# EAGLE design ibee (EAGLE 6.6.0)
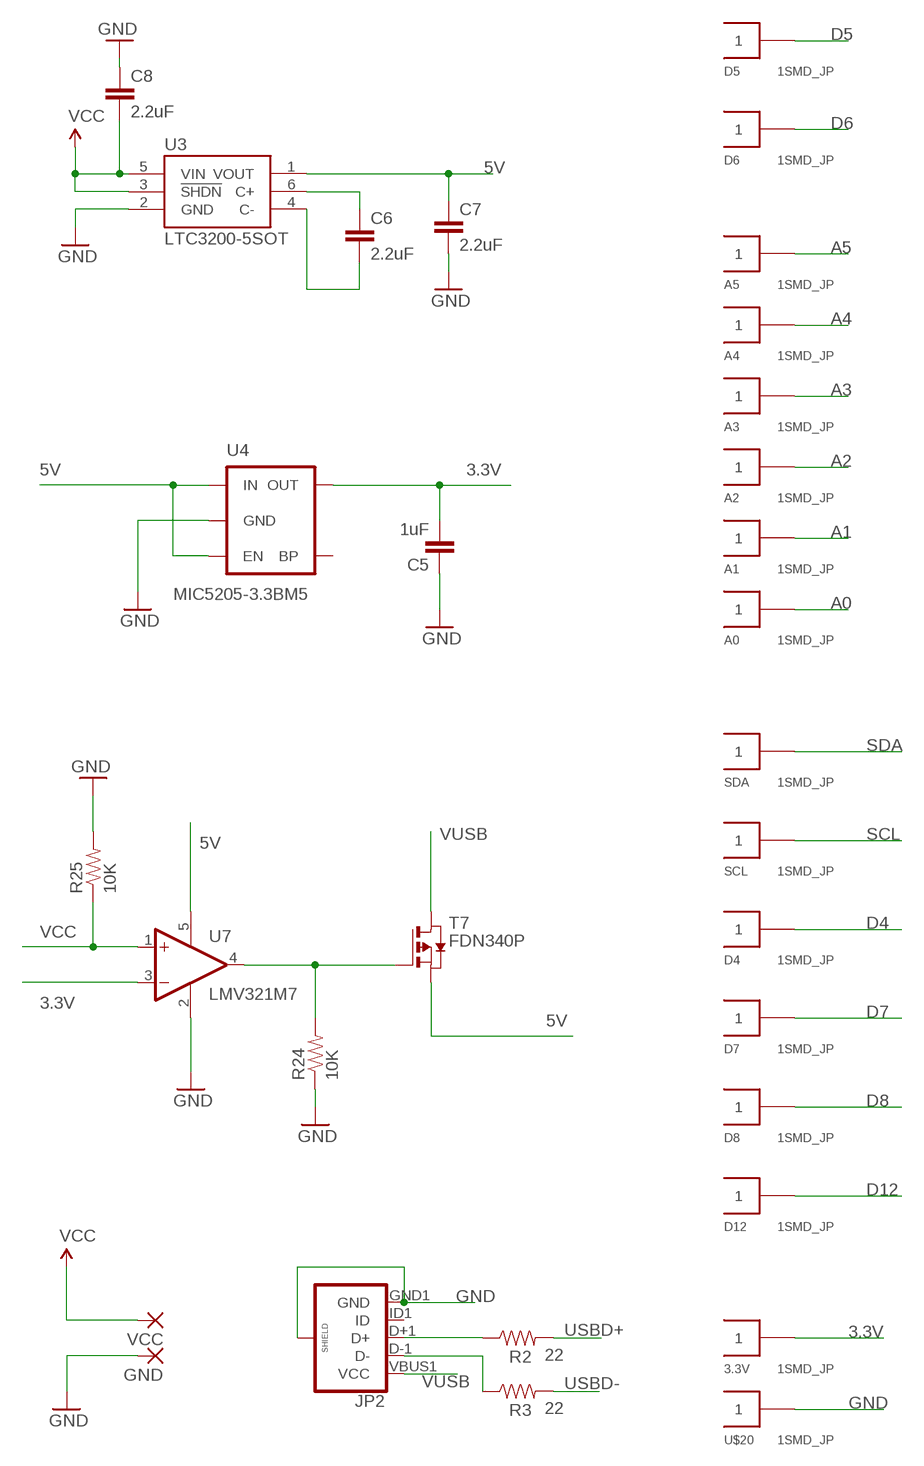
[diagram p0: schematic, sheet 1, part 1 of 2]
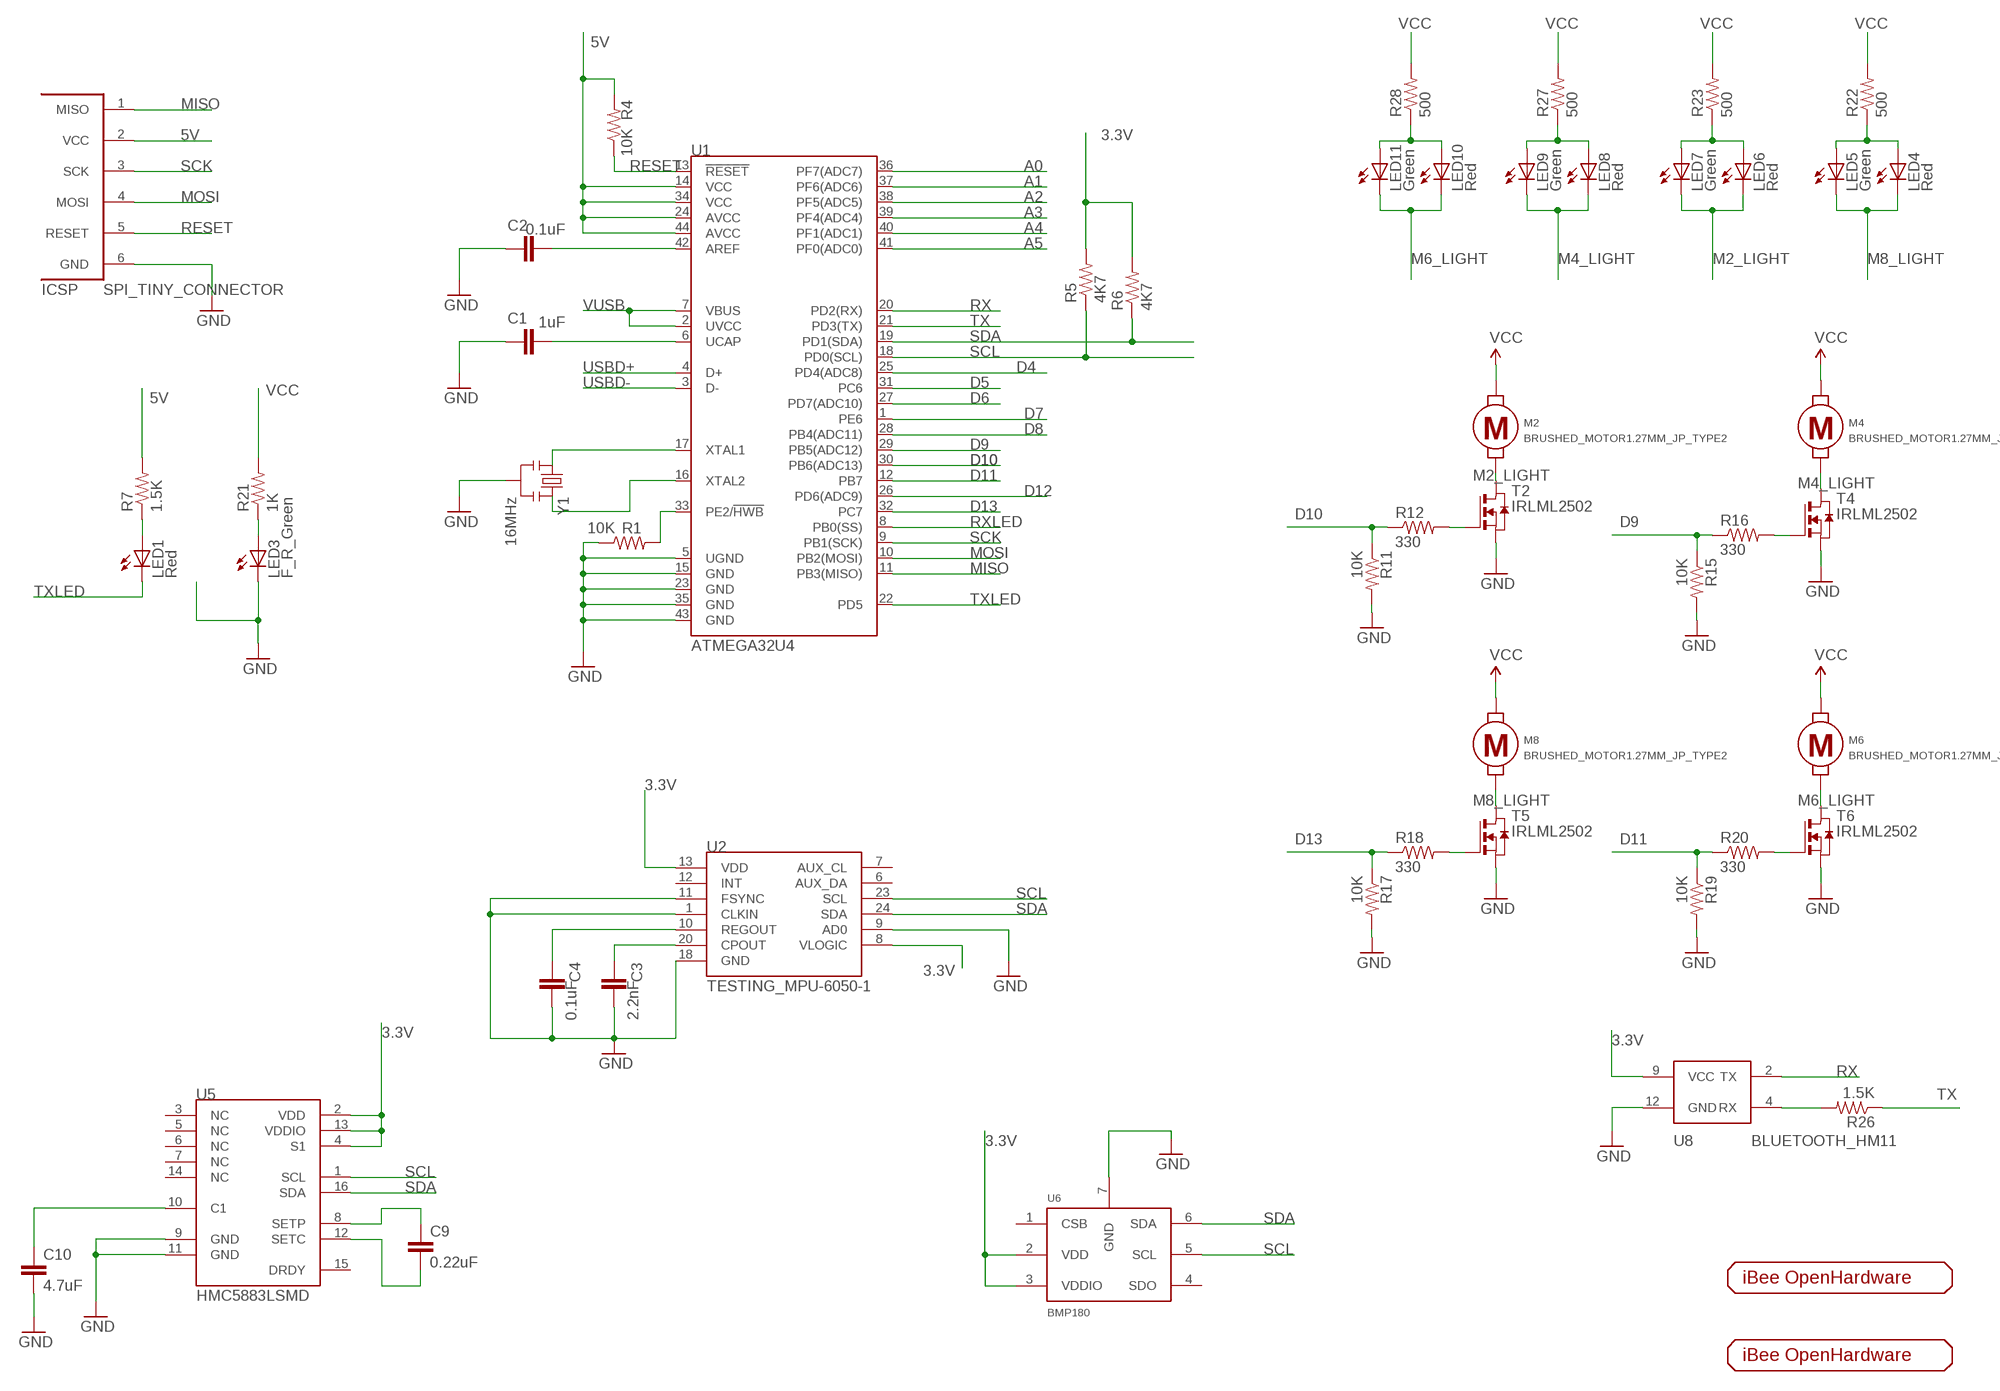
[diagram p1: schematic, sheet 1, part 2 of 2]

## Parts
3.3V  1SMD_JP  [1SMD]
A0  1SMD_JP  [1SMD]
A1  1SMD_JP  [1SMD]
A2  1SMD_JP  [1SMD]
A3  1SMD_JP  [1SMD]
A4  1SMD_JP  [1SMD]
A5  1SMD_JP  [1SMD]
C1  1uF  CAP0402-CAP  [0402-CAP]
C2  0.1uF  CAP0402-CAP  [0402-CAP]
C3  2.2nF  CAP0402-CAP  [0402-CAP]
C4  0.1uF  CAP0402-CAP  [0402-CAP]
C5  1uF  CAP0402-CAP  [0402-CAP]
C6  2.2uF  CAP0603-CAP  [0603-CAP]
C7  2.2uF  CAP0603-CAP  [0603-CAP]
C8  2.2uF  CAP0603-CAP  [0603-CAP]
C9  0.22uF  CAP0402-CAP  [0402-CAP]
C10  4.7uF  CAP0603-CAP  [0603-CAP]
D4  1SMD_JP  [1SMD]
D5  1SMD_JP  [1SMD]
D6  1SMD_JP  [1SMD]
D7  1SMD_JP  [1SMD]
D8  1SMD_JP  [1SMD]
D12  1SMD_JP  [1SMD]
GND  2,15/1,0  [2,15/1,0]
ICSP  SPI_TINY_CONNECTOR  AVR_ISP_TINY_CONNECTORAVR_ISP_TINY_CONNCTOR_NO_BORDER  [AVR_ISP_TINY_CONNECTOR_NO_BORDER]
JP2  USB_MICROB_PLUGCONN-11752  [USB-B-MICRO-SMD_V03]
LED1  Red  LEDCHIPLED_0603  [CHIPLED_0603]
LED3  F_R_Green  LEDCHIPLED_0603  [CHIPLED_0603]
LED4  Red  LEDCHIPLED_0603  [CHIPLED_0603]
LED5  Green  LEDCHIPLED_0603  [CHIPLED_0603]
LED6  Red  LEDCHIPLED_0603  [CHIPLED_0603]
LED7  Green  LEDCHIPLED_0603  [CHIPLED_0603]
LED8  Red  LEDCHIPLED_0603  [CHIPLED_0603]
LED9  Green  LEDCHIPLED_0603  [CHIPLED_0603]
LED10  Red  LEDCHIPLED_0603  [CHIPLED_0603]
LED11  Green  LEDCHIPLED_0603  [CHIPLED_0603]
M2  BRUSHED_MOTOR1.27MM_JP_TYPE2  [BRUSHED_MOTOR_1.27MM_JP_TYPE2]
M4  BRUSHED_MOTOR1.27MM_JP  [BRUSHED_MOTOR_1.27MM_JP]
M6  BRUSHED_MOTOR1.27MM_JP  [BRUSHED_MOTOR_1.27MM_JP]
M8  BRUSHED_MOTOR1.27MM_JP_TYPE2  [BRUSHED_MOTOR_1.27MM_JP_TYPE2]
R1  10K  RESISTOR0402-RES  [0402-RES]
R2  22  RESISTOR0402-RES  [0402-RES]
R3  22  RESISTOR0402-RES  [0402-RES]
R4  10K  RESISTOR0402-RES  [0402-RES]
R5  4K7  RESISTOR0402-RES  [0402-RES]
R6  4K7  RESISTOR0402-RES  [0402-RES]
R7  1.5K  RESISTOR0402-RES  [0402-RES]
R11  10K  RESISTOR0402-RES  [0402-RES]
R12  330  RESISTOR0402-RES  [0402-RES]
R15  10K  RESISTOR0402-RES  [0402-RES]
R16  330  RESISTOR0402-RES  [0402-RES]
R17  10K  RESISTOR0402-RES  [0402-RES]
R18  330  RESISTOR0402-RES  [0402-RES]
R19  10K  RESISTOR0402-RES  [0402-RES]
R20  330  RESISTOR0402-RES  [0402-RES]
R21  1K  RESISTOR0402-RES  [0402-RES]
R22  500  RESISTOR0402-RES  [0402-RES]
R23  500  RESISTOR0402-RES  [0402-RES]
R24  10K  RESISTOR0402-RES  [0402-RES]
R25  10K  RESISTOR0402-RES  [0402-RES]
R26  1.5K  RESISTOR0402-RES  [0402-RES]
R27  500  RESISTOR0402-RES  [0402-RES]
R28  500  RESISTOR0402-RES  [0402-RES]
SCL  1SMD_JP  [1SMD]
SDA  1SMD_JP  [1SMD]
T2  IRLML2502  NMOSSOT23  [SOT-23]
T4  IRLML2502  NMOSSOT23  [SOT-23]
T5  IRLML2502  NMOSSOT23  [SOT-23]
T6  IRLML2502  NMOSSOT23  [SOT-23]
T7  FDN340P  [SOT23]
U1  ATMEGA32U4  [TESTING_QFN-44-7X7]
U2  TESTING_MPU-6050-1  [TESTING_QFN-24-4MM2]
U3  LTC3200-5SOT  [SOT23-6]
U4  MIC5205-3.3BM5  MIC52053.3V  [SOT23-5]
U5  HMC5883LSMD  [TESTING_16LPCC]
U6  BMP180  [BMP180]
U7  LMV321M7  [SC70-5L]
U8  BLUETOOTH_HM11  [BLUETOOTH_HM11]
U$1  IBEE-LOGO-T  [IBEE-LOGO-TOP]
U$2  IBEE-LOGO-B  [FLEXBOT_LOGO_TYPE2]
U$20  1SMD_JP  [1SMD]
VCC  2,15/1,0  [2,15/1,0]
Y1  16MHz  RESONATOR16MHZ  [RESONATOR-SMD]

## Nets
3.3V: 3.3V.1 C5.2 R5.2 R6.2 U2.8(VLOGIC) U2.13(VDD) U4.5(OUT) U5.2(VDD) U5.4(S1) U5.13(VDDIO) U6.2(VDD) U6.3(VDDIO) U7.3(-IN) U8.9(VCC)
5V: C7.1 ICSP.2(VCC) R4.2 R7.2 T7.2(S) U1.14(VCC) U1.24(AVCC) U1.34(VCC) U1.44(AVCC) U3.1(VOUT) U4.1(IN) U4.3(EN) U7.5(V+)
A0: A0.1 U1.36(PF7(ADC7))
A1: A1.1 U1.37(PF6(ADC6))
A2: A2.1 U1.38(PF5(ADC5))
A3: A3.1 U1.39(PF4(ADC4))
A4: A4.1 U1.40(PF1(ADC1))
A5: A5.1 U1.41(PF0(ADC0))
D4: D4.1 U1.25(PD4(ADC8))
D5: D5.1 U1.31(PC6)
D6: D6.1 U1.27(PD7(ADC10))
D7: D7.1 U1.1(PE6)
D8: D8.1 U1.28(PB4(ADC11))
D9: R15.1 R16.1 U1.29(PB5(ADC12))
D10: R11.1 R12.1 U1.30(PB6(ADC13))
D11: R19.1 R20.1 U1.12(PB7)
D12: D12.1 U1.26(PD6(ADC9))
D13: R17.1 R18.1 U1.32(PC7)
GND: C1.1 C2.1 C3.2 C4.2 C5.1 C7.2 C8.1 C10.2 GND.1(P) ICSP.6(GND) JP2.GND1(GND) JP2.SHIELD1(SHIELD) JP2.SHIELD2(SHIELD) JP2.SHIELD3(SHIELD) LED3.C R1.1 R11.2 R15.2 R17.2 R19.2 R24.1 R25.2 T2.2(S) T4.2(S) T5.2(S) T6.2(S) U1.5(UGND) U1.15(GND) U1.23(GND) U1.35(GND) U1.43(GND) U2.1(CLKIN) U2.9(AD0) U2.11(FSYNC) U2.18(GND) U3.2(GND) U4.2(GND) U5.9(GND) U5.11(GND) U6.7(GND) U7.2(V-) U8.12(GND) U$20.1 Y1.2
M2_LIGHT: LED6.C LED7.C M2.P$1 T2.1(D)
M4_LIGHT: LED8.C LED9.C M4.P$1 T4.1(D)
M6_LIGHT: LED10.C LED11.C M6.P$1 T6.1(D)
M8_LIGHT: LED4.C LED5.C M8.P$1 T5.1(D)
MISO: ICSP.1(MISO) U1.11(PB3(MISO))
MOSI: ICSP.4(MOSI) U1.10(PB2(MOSI))
N$1: U1.17(XTAL1) Y1.1
N$2: U1.16(XTAL2) Y1.3
N$3: JP2.D+1(D+) R2.1
N$4: JP2.D-1(D-) R3.1
N$5: C1.2 U1.6(UCAP)
N$6: C2.2 U1.42(AREF)
N$8: C4.1 U2.10(REGOUT)
N$9: C3.1 U2.20(CPOUT)
N$10: LED1.A R7.1
N$11: R1.2 U1.33(PE2/!HWB)
N$12: R18.2 T5.3(G)
N$13: LED3.A R21.1
N$14: R12.2 T2.3(G)
N$17: LED8.A LED9.A R27.1
N$20: R16.2 T4.3(G)
N$21: LED10.A LED11.A R28.1
N$22: LED6.A LED7.A R23.1
N$23: C9.1 U5.8(SETP)
N$24: LED4.A LED5.A R22.1
N$25: C6.1 U3.6(C+)
N$27: C6.2 U3.4(C-)
N$28: C9.2 U5.12(SETC)
N$29: C10.1 U5.10(C1)
N$31: R20.2 T6.3(G)
N$34: R24.2 T7.3(G) U7.4(OUT)
N$35: R26.2 U8.4(RX)
RESET: ICSP.5(RESET) R4.1 U1.13(!RESET)
RX: U1.20(PD2(RX)) U8.2(TX)
RXLED: U1.8(PB0(SS))
SCK: ICSP.3(SCK) U1.9(PB1(SCK))
SCL: R5.1 SCL.1 U1.18(PD0(SCL)) U2.23(SCL) U5.1(SCL) U6.5(SCL)
SDA: R6.1 SDA.1 U1.19(PD1(SDA)) U2.24(SDA) U5.16(SDA) U6.6(SDA)
TX: R26.1 U1.21(PD3(TX))
TXLED: LED1.C U1.22(PD5)
USBD+: R2.2 U1.4(D+)
USBD-: R3.2 U1.3(D-)
VCC: C8.2 M2.P$2 M4.P$2 M6.P$2 M8.P$2 R21.2 R22.2 R23.2 R25.1 R27.2 R28.2 U3.3(!SHDN) U3.5(VIN) U7.1(+IN) VCC.1(P)
VUSB: JP2.VBUS1(VCC) T7.1(D) U1.2(UVCC) U1.7(VBUS)
Unconnected: JP2.ID1(ID) U2.6(AUX_DA) U2.7(AUX_CL) U2.12(INT) U4.4(BP) U5.3(NC) U5.5(NC) U5.6(NC) U5.7(NC) U5.14(NC) U5.15(DRDY) U6.1(CSB) U6.4(SDO)

## Library data of the parts
3.3V A0 A1-A5 D4-D8 D12 SCL SDA U$20 = HexAirbot-HexNano:1SMD_JP
C1-C10 = SparkFun-Passives:CAP: Capacitor Standard 0603 ceramic capacitor, and 0.1" leaded capacitor.
GND VCC = wirepad:2,15/1,0: THROUGH-HOLE PAD
ICSP = ehl:AVR_ISP_TINY_CONNECTOR
JP2 = ehl:USB_MICROB_PLUG: USB Micro-B connectors Some male, some female. Watch your step!; PROD_ID: CONN-11752
LED1 LED3-LED11 = led:LED: LED OSRAM: - CHIPLED LG R971, LG N971, LY N971, LG Q971, LY Q971, LO R971, LY R971 LH N974, LH R974 LS Q976, LO Q976, LY Q976 LO Q996 - Hyper CHIPLED LW Q18S LB Q993, LB Q99A, LB R99A - SideLED LS A670, LO A670, LY A670, LG A670, LP A670 LB A673, LV A673, LT A673, LW A673 LH A674 LY A675 LS A676, LA A676, LO A676, LY A676, LW A676 LS A679, LY A679, LG A679 - Hyper Micro SIDELED® LS Y876, LA Y876, LO Y876, LY Y876 LT Y87S - SmartLED LW L88C, LW L88S LB L89C, LB L89S, LG L890 LS L89K, LO L89K, LY L89K LS L896, LA L896, LO L896, LY L896 - TOPLED LS T670, LO T670, LY T670, LG T670, LP T670 LSG T670, LSP T670, LSY T670, LOP T670, LYG T670 LG T671, LOG T671, LSG T671 LB T673, LV T673, LT T673, LW T673 LH T674 LS T676, LA T676, LO T676, LY T676, LB T676, LH T676, LSB T676, LW T676 LB T67C, LV T67C, LT T67C, LS T67K, LO T67K, LY T67K, LW E67C LS E67B, LA E67B, LO E67B, LY E67B, LB E67C, LV E67C, LT E67C LW T67C LS T679, LY T679, LG T679 LS T770, LO T770, LY T770, LG T770, LP T770 LB T773, LV T773, LT T773, LW T773 LH T774 LS E675, LA E675, LY E675, LS T675 LS T776, LA T776, LO T776, LY T776, LB T776 LHGB T686 LT T68C, LB T68C - Hyper Mini TOPLED® LB M676 - Mini TOPLED Santana® LG M470 LS M47K, LO M47K, LY M47K Source: http://www.osram.convergy.de LUXEON: - LUMILED® LXK2-PW12-R00, LXK2-PW12-S00, LXK2-PW14-U00, LXK2-PW14-V00 LXK2-PM12-R00, LXK2-PM12-S00, LXK2-PM14-U00 LXK2-PE12-Q00, LXK2-PE12-R00, LXK2-PE12-S00, LXK2-PE14-T00, LXK2-PE14-U00 LXK2-PB12-K00, LXK2-PB12-L00, LXK2-PB12-M00, LXK2-PB14-N00, LXK2-PB14-P00, LXK2-PB14-Q00 LXK2-PR12-L00, LXK2-PR12-M00, LXK2-PR14-Q00, LXK2-PR14-R00 LXK2-PD12-Q00, LXK2-PD12-R00, LXK2-PD12-S00 LXK2-PH12-R00, LXK2-PH12-S00 LXK2-PL12-P00, LXK2-PL12-Q00, LXK2-PL12-R00 Source: www.luxeon.com KINGBRIGHT: KA-3528ASYC Source: www.kingbright.com
M2 M4 M6 M8 = HexAirbot-HexNano:BRUSHED_MOTOR
R1-R7 R11 R12 R15-R28 = SparkFun-Passives:RESISTOR: Resistor Basic schematic elements and footprints for 0603, 1206, and PTH resistors.
T2 T4-T6 = zetex:NMOSSOT23: MOS FET; OC_FARNELL: unknown; OC_NEWARK: unknown
T7 = HexAirbot-HexNano:FDN340P: MOS FET
U1 = ehl:ATMEGA32U4: Atmel 44-pin 8-bit Microcontroller with 32KBytes of ISP Flash and USB Controller ----- Please use the QFN-44-NOPAD_1:1 package for the footprint of all boards using a 32U4. Route traces directly away from the pads as much as possible.
U2 = MPU6050:TESTING_MPU-6050
U3 = HexAirbot-HexNano:LTC3200-5: Linear Technology. Low Noise, Regulated Charge Pump DC/DC Converters, SOT23-6. Fixed 5V ± 4% Output or ADJ VIN Range: 2.7V to 4.5V
U4 = SparkFun-PowerIC:MIC5205: MIC5205 150mA vreg 3.3V - VREG-00822 5V - VREG-00823; PROD_ID: VREG-00822
U5 = ehl:HMC5883L: 3 Axis Digital Compass IC
U6 = ehl:BMP180
U7 = linear:LMV321?*: General Purpose, Low Voltage, Rail-to-Rail Output Operational Amplifiers Source: http://www.national.com/mpf/LM/LMV321.html http://www.national.com/dt/lmv_qual.pdf
U8 = HexAirbot-HexNano:BLUETOOTH_HM11: BLE 4.0 Module
U$1 = ehl:IBEE-LOGO-T
U$2 = ehl:IBEE-LOGO-B
Y1 = SparkFun-FreqCtrl:RESONATOR: Resonator Small SMD resonator. Used, eg, on the Arduino Pro/ Pro Mini boards. 8MHz- XTAL-08895 16MHz- XTAL-08900; PROD_ID: XTAL-08900

## Board
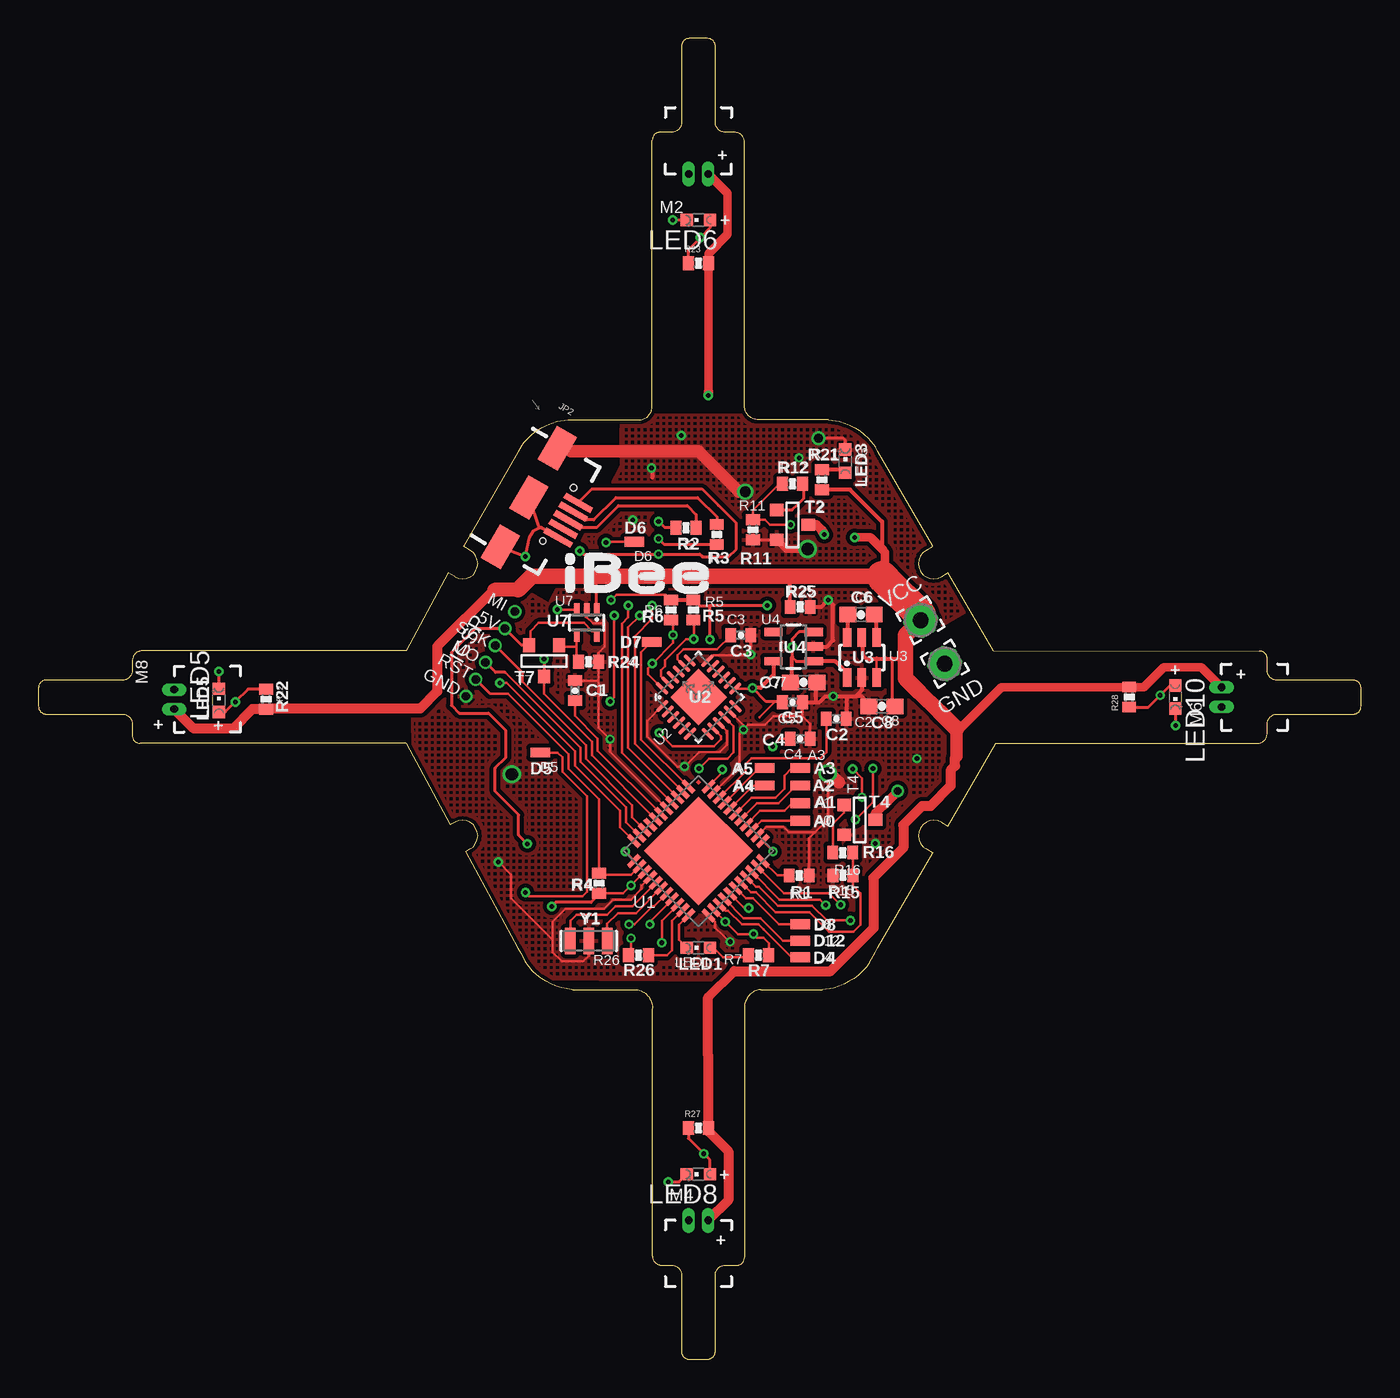
[diagram p2: board, top side]
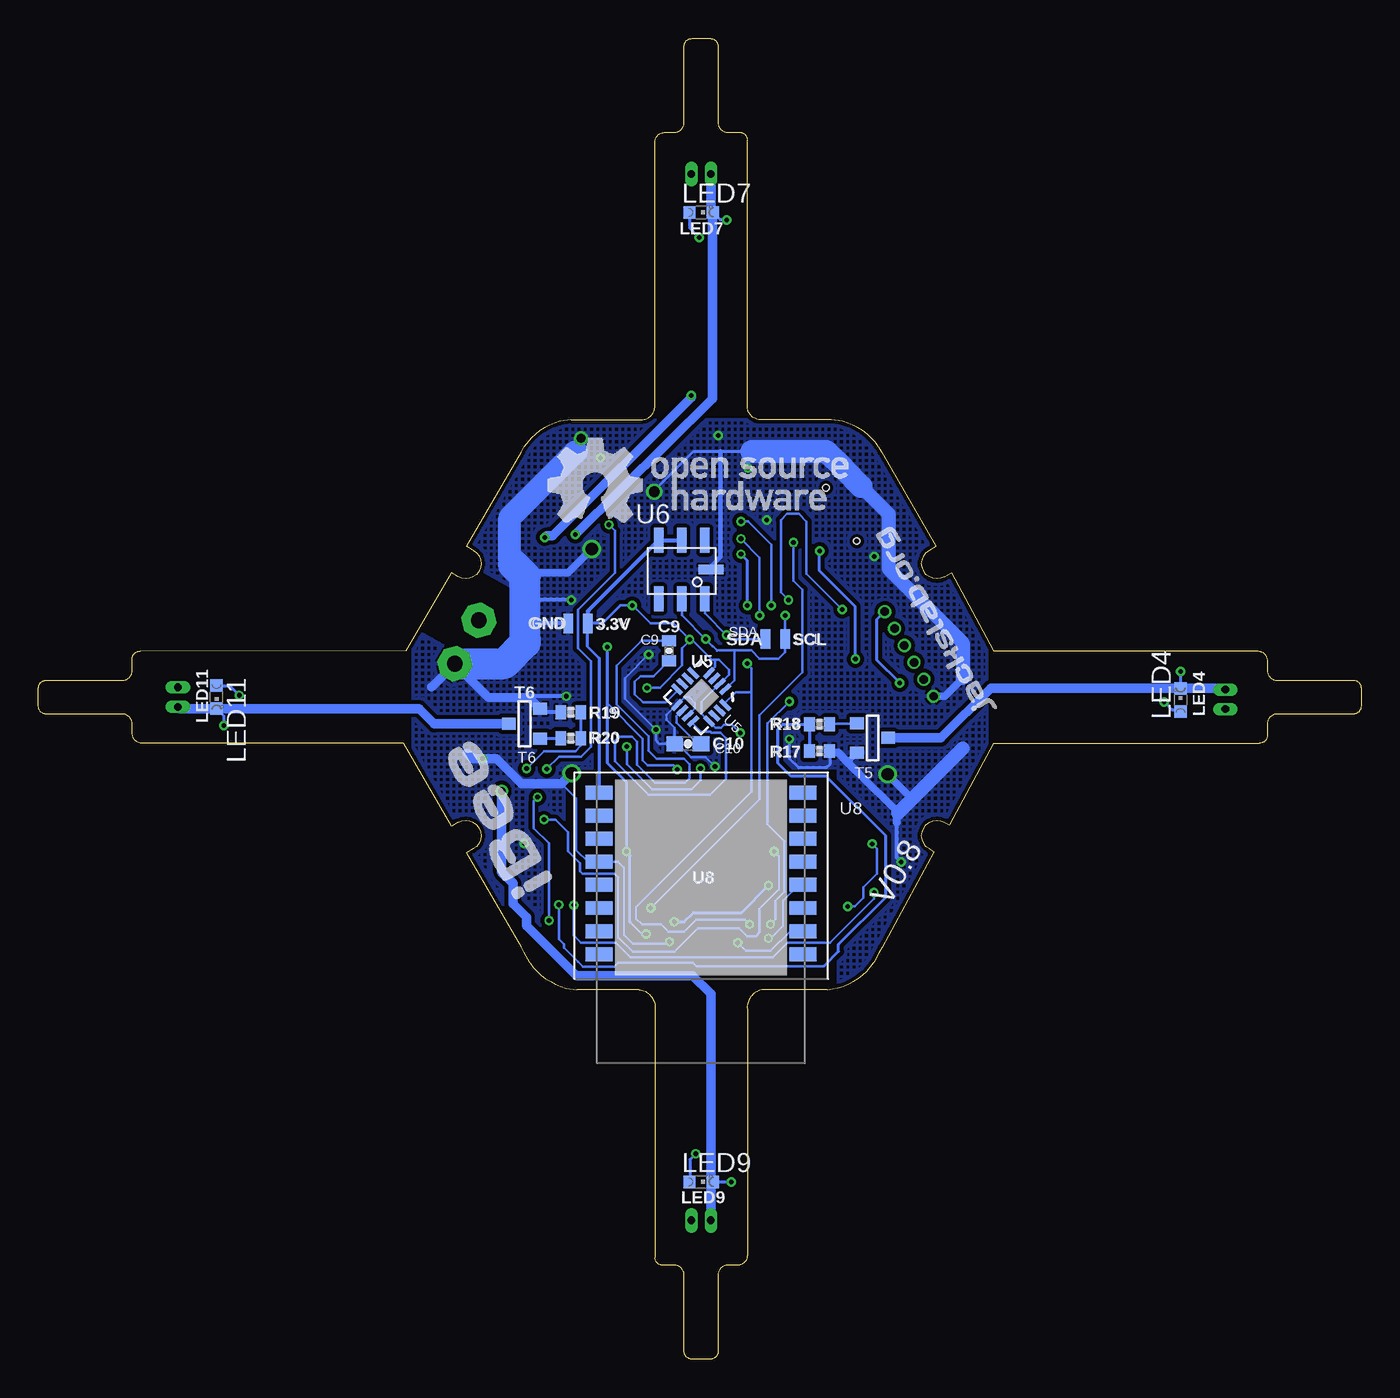
[diagram p3: board, bottom side, seen from below]

Size 85.98 x 85.82 mm. Coordinates in mm from the lower left corner, seen from the top.
Outline: 62.07,46.03 59.13,51.09 58.7,50.84 58.47,50.73 58.19,50.71 57.94,50.73 57.71,50.84 57.5,50.99 57.33,51.19 57.23,51.44 57.2,51.7 57.23,51.95 57.33,52.21 57.5,52.41 57.71,52.56 58.14,52.82 54.58,58.96 54.41,59.29 53.95,59.85 53.67,60.11 53.39,60.33 53.09,60.51 52.75,60.69 52.42,60.82 52.07,60.94 51.36,61.05 46.78,61.05 arc-90 45.9,61.92
Outline: 54.41,26.43 54.58,26.76 58.14,32.9 57.71,33.16 57.5,33.31 57.33,33.51 57.23,33.77 57.2,34.02 57.23,34.27 57.33,34.5 57.5,34.73 57.71,34.88 57.94,34.99 58.19,35.01 58.47,34.99 58.7,34.88 59.13,34.63 62.25,40.01
Outline: 31.33,26.4 31.14,26.74 27.75,32.96 28.07,33.16 28.27,33.31 28.42,33.51 28.52,33.77 28.57,34.02 28.52,34.27 28.42,34.5 28.27,34.73 28.07,34.88 27.84,34.99 27.56,35.01 27.3,34.99 27.08,34.88 26.77,34.74 23.9,40.02
Outline: 23.9,46.02 26.64,51.09 27.08,50.84 27.3,50.73 27.56,50.71 27.84,50.73 28.07,50.84 28.27,50.99 28.42,51.19 28.52,51.44 28.57,51.7 28.52,51.95 28.42,52.21 28.27,52.41 28.07,52.56 27.63,52.82 31.19,58.96 31.37,59.29 31.57,59.57 31.83,59.85 32.08,60.11 32.38,60.33 32.69,60.51 33.02,60.69 33.35,60.82 33.7,60.94 34.42,61.05
Outline: 23.9,40.02 6.6,40.02
Outline: 6.6,40.02 arc-90 6.1,40.52 6.1,41.29 arc90 5.46,41.92 0.5,41.92 arc-90 0,42.42 0,43.62 arc-90 0.5,44.12 5.46,44.12 arc90 6.1,44.76 6.1,45.39 arc-90 6.73,46.02 23.9,46.02
Outline: 62.07,46.03 79.37,46.01
Outline: 79.38,46.01 arc-90 79.88,45.51 79.88,44.75 arc90 80.51,44.11 85.48,44.11 arc-90 85.98,43.61 85.98,42.41 arc-90 85.48,41.91 80.51,41.91 arc90 79.88,41.28 79.88,40.65 arc-90 79.24,40.01 62.25,40.01
Outline: 39.9,61.92 39.9,79.22
Outline: 39.9,79.22 arc-90 40.4,79.72 41.16,79.72 arc90 41.8,80.36 41.8,85.32 arc-90 42.3,85.82 43.5,85.82 arc-90 44,85.32 44,80.36 arc90 44.63,79.72 45.27,79.72 arc-90 45.9,79.09 45.9,61.92
Outline: 45.9,6.6 45.9,22.73 arc-90 46.94,24.01
Outline: 45.9,6.6 arc-90 45.4,6.1 44.63,6.1 arc90 44,5.46 44,0.5 arc-90 43.5,0 42.3,0 arc-90 41.8,0.5 41.8,5.46 arc90 41.16,6.1 40.53,6.1 arc-90 39.9,6.73 39.9,22.73
Outline: 39.9,22.73 arc90 38.85,24.01 34.71,24.02
Outline: 34.41,61.04 39.02,61.04 arc90 39.9,61.92
Outline: 34.7,24.02 34.36,24.06 33.99,24.14 33.64,24.23 33.29,24.38 32.99,24.55 32.67,24.75 32.39,24.97 32.1,25.22 31.66,25.78
Outline: 31.32,26.4 31.66,25.78
Outline: 54.02,25.76 53.81,25.48 53.56,25.2 53.31,24.95 53,24.72 52.7,24.54 52.37,24.36 52.04,24.24 51.68,24.11 50.97,24.01
Outline: 46.94,24.01 50.97,24.01
Outline: 54.02,25.76 54.41,26.43
Copper layers (1*16): Top 0.035mm / dielectric 1.5mm / Bottom 0.035mm
Design rules "jackslab-micromod": minimum track width 6mil, minimum drill 0.3mm, track to track 6mil, track to pad 6mil, pad to pad 6mil, via to via 6mil, smd to smd 6mil, copper to edge 6mil, drill to drill 6mil, minimum pad ring 6mil, minimum via ring 6mil, stop-mask expansion 4mil, vias tented up to drill 20mil, thermal gap 6mil

### Footprints (pad centres in the part's own frame; a part is rotated, then mirrored left to right if it is on the bottom)
1SMD = smd 1.27 x 0.635: 1 0,0
0402-CAP = smd 0.7 x 0.9: 1 -0.65,0; 2 0.65,0
0603-CAP = smd 1.1 x 1: 1 -0.85,0; 2 0.85,0
2,15/1,0 = drill 1.016 pad 2.159 octagon: 1 0,0
AVR_ISP_TINY_CONNECTOR_NO_BORDER = drill 0.55: 1 0,0; 2 0,-1.27; 3 0,-2.54; 4 0,-3.81; 5 0,-5.08; 6 0,-6.35
USB-B-MICRO-SMD_V03 = smd 2 x 0.4: D+1 2.954,0; D-1 2.954,0.65; GND1 2.954,-1.3; ID1 2.954,-0.65; VBUS1 2.954,1.3 | smd 1.5 x 2.5: SHIELD1 0,3.7; SHIELD2 0,-3.7; SHIELD3 0,0 | hole 0.4: 2.2,2; 2.2,-2
CHIPLED_0603 = smd 0.8 x 0.8: A 0,-0.75; C 0,0.75
BRUSHED_MOTOR_1.27MM_JP_TYPE2 = drill 0.5 long: P$1 -0.635,0; P$2 0.635,0
BRUSHED_MOTOR_1.27MM_JP = drill 0.5 long: P$1 -0.635,0; P$2 0.635,0
0402-RES = smd 0.7 x 0.9: 1 -0.65,0; 2 0.65,0
SOT-23 = smd 0.787 x 0.889: 1 0.025,-1.016; 2 -0.94,1.016; 3 0.991,1.016
SOT23 = smd 0.787 x 0.889: 1 0.025,-1.016; 2 -0.94,1.016; 3 0.991,1.016
TESTING_QFN-44-7X7 = smd 1 x 0.3: 1 -3.425,2.5; 2 -3.425,2; 3 -3.425,1.5; 4 -3.425,1; 5 -3.425,0.5; 6 -3.425,0; 7 -3.425,-0.5; 8 -3.425,-1; 9 -3.425,-1.5; 10 -3.425,-2; 11 -3.425,-2.5; 23 3.425,-2.5; 24 3.425,-2; 25 3.425,-1.5; 26 3.425,-1; 27 3.425,-0.5; 28 3.425,0; 29 3.425,0.5; 30 3.425,1; 31 3.425,1.5; 32 3.425,2; 33 3.425,2.5 | smd 0.3 x 1: 12 -2.5,-3.425; 13 -2,-3.425; 14 -1.5,-3.425; 15 -1,-3.425; 16 -0.5,-3.425; 17 0,-3.425; 18 0.5,-3.425; 19 1,-3.425; 20 1.5,-3.425; 21 2,-3.425; 22 2.5,-3.425; 34 2.5,3.425; 35 2,3.425; 36 1.5,3.425; 37 1,3.425; 38 0.5,3.425; 39 0,3.425; 40 -0.5,3.425; 41 -1,3.425; 42 -1.5,3.425; 43 -2,3.425; 44 -2.5,3.425 | smd 5 x 5: TH 0,0
TESTING_QFN-24-4MM2 = smd 1.016 x 0.254: 1 -2.066,1.257; 2 -2.066,0.75; 3 -2.066,0.247; 4 -2.066,-0.287; 5 -2.066,-0.792; 6 -2.066,-1.297; 13 2.086,-1.297; 14 2.086,-0.792; 15 2.086,-0.287; 16 2.086,0.247; 17 2.086,0.75; 18 2.086,1.257 | smd 0.254 x 1.016: 7 -1.267,-2.122; 8 -0.762,-2.122; 9 -0.258,-2.122; 10 0.278,-2.122; 11 0.78,-2.122; 12 1.287,-2.122; 19 1.287,2.082; 20 0.78,2.082; 21 0.278,2.082; 22 -0.258,2.082; 23 -0.762,2.082; 24 -1.267,2.082 | smd 2.616 x 2.616: P$1 0.02,-0.01
SOT23-6 = smd 0.55 x 1.2: 1 -0.95,-1.3; 2 0,-1.3; 3 0.95,-1.3; 4 0.95,1.3; 5 0,1.3; 6 -0.95,1.3
SOT23-5 = smd 0.55 x 1.2: 1 -0.95,-1.3; 2 0,-1.3; 3 0.95,-1.3; 4 0.95,1.3; 5 -0.95,1.3
TESTING_16LPCC = smd 0.85 x 0.28: 1 -1.47,0.75; 2 -1.47,0.25; 3 -1.47,-0.25; 4 -1.47,-0.75; 9 1.47,-0.75; 10 1.47,-0.25; 11 1.47,0.25; 12 1.47,0.75 | smd 0.28 x 0.85: 5 -0.75,-1.47; 6 -0.25,-1.47; 7 0.25,-1.47; 8 0.75,-1.47; 13 0.75,1.47; 14 0.25,1.47; 15 -0.25,1.47; 16 -0.75,1.47
BMP180 = smd 0.6 x 1.6: 1 1.5,1.9; 2 0,1.9; 3 -1.5,1.9; 4 -1.5,-1.9; 5 0,-1.9; 6 1.5,-1.9 | smd 1.6 x 0.6: 7 1.9,0
SC70-5L = smd 0.35 x 0.8: 1 -0.65,-0.85; 2 0,-0.85; 3 0.65,-0.85; 4 0.65,0.85; 5 -0.65,0.85
BLUETOOTH_HM11 = smd 1.75 x 0.9: 1 -6.625,4.859; 2 -6.625,3.359; 3 -6.625,1.859; 4 -6.625,0.359; 5 -6.625,-1.141; 6 -6.625,-2.641; 7 -6.625,-4.141; 8 -6.625,-5.641; 9 6.625,-5.641; 10 6.625,-4.141; 11 6.625,-2.641; 12 6.625,-1.141; 13 6.625,0.359; 14 6.625,1.859; 15 6.625,3.359; 16 6.625,4.859
RESONATOR-SMD = smd 0.7 x 1.7: 1 -1.2,0; 2 0,0; 3 1.2,0

### Placement (x,y rotation side)
3.3V  50.27,47.81 270 bottom
A0  49.5,34.99 0 top
A1  49.52,36.13 0 top
A2  49.5,37.27 0 top
A3  49.5,38.41 0 top
A4  47.22,37.27 0 top
A5  47.22,38.41 0 top
C1  34.87,43.44 270 top
C2  51.86,41.62 180 top
C3  45.66,47.05 0 top
C4  49.52,40.31 0 top
C5  49.01,42.68 180 top
C6  53.48,48.38 0 top
C7  49.75,43.98 0 top
C8  54.83,42.42 0 top
C9  44.98,46.03 90 bottom
C10  43.76,39.99 180 bottom
D4  49.53,26.12 0 top
D5  32.62,39.42 0 top
D6  38.72,53.12 0 top
D7  39.86,46.61 0 top
D8  49.5,28.25 0 top
D12  49.5,27.19 0 top
GND  58.91,45.19 120 top
ICSP  30.96,48.57 330 top
JP2  31.88,55.99 330 top
LED1  42.9,26.73 90 top
LED3  52.45,58.35 0 top
LED4  11.73,42.83 0 bottom
LED5  11.73,42.81 0 top
LED6  42.9,74.02 90 top
LED7  42.9,74.52 270 bottom
LED8  42.9,12.02 90 top
LED9  42.9,11.52 270 bottom
LED10  73.9,43.02 180 top
LED11  74.4,43.02 180 bottom
M2  42.9,77.02 0 top
M4  42.9,9.02 0 top
M6  76.9,43.02 90 top
M8  8.83,42.88 270 top
R1  49.45,31.43 180 top
R2  42.09,54.04 180 top
R3  44.09,53.59 270 top
R4  36.45,30.92 270 top
R5  42.57,48.68 90 top
R6  41.12,48.68 90 top
R7  46.81,26.24 0 top
R11  46.44,53.9 270 top
R12  49.01,56.88 0 top
R15  52.3,31.43 180 top
R16  52.29,32.92 180 top
R17  35.2,39.52 0 bottom
R18  35.2,41.26 0 bottom
R19  51.37,42.03 180 bottom
R20  51.37,40.36 180 bottom
R21  50.94,57.15 270 top
R22  14.81,42.89 270 top
R23  42.9,71.21 0 top
R24  35.76,45.32 180 top
R25  49.52,48.88 0 top
R26  39.01,26.24 180 top
R27  42.9,15.02 0 top
R28  70.9,43.02 90 top
SCL  37.44,46.8 270 bottom
SDA  38.71,46.8 270 bottom
T2  49.02,54.19 90 top
T4  53.39,35.02 90 top
T5  31.75,40.34 90 bottom
T6  54.38,41.31 270 bottom
T7  32.84,45.37 0 top
U1  42.9,33.02 315 top
U2  42.9,43.02 45 top
U3  53.53,45.59 0 top
U4  49.08,46.3 90 top
U5  42.9,43.02 225 bottom
U6  44.16,51.31 0 bottom
U7  35.64,47.86 180 top
U8  42.9,31.18 180 bottom
U$1  34.19,52.52 0 top
U$2  49.86,56.83 0 bottom
U$20  51.54,47.81 270 bottom
VCC  57.34,48.02 120 top
Y1  35.78,27.18 180 top

### Tracks (layer width: path | path; a pad name or v marks a point on that pad's centre or on a via)
3.3V  (via drill 0.3)
  Top 0.152: 47.08,48.97 47.09,48.98 | R6.2 40.77,49.68 37.57,49.68 v37.22,49.34 | U7.3 v33.73,48.71 | 46.86,41.72 47.87,42.73 | U2.8 44.37,40.47 44.37,40.29 43.92,39.84 41.22,39.84 v40.36,40.7 | U2.13 46.38,43.58 v46.42,43.62
  Top 0.203: 47.08,48.97 43.66,48.97 | 47.09,48.98 v47.37,48.98 | v43.65,46.77 43.65,48.96 43.66,48.97 | 48.31,42.73 47.87,42.73 47.31,42.73 v46.42,43.62 | R5.2 42.92,48.97 43.66,48.97
  Top 0.254: R5.2 R6.2 | 48.31,42.73 C5.2 | U4.5 47.78,44.46 46.94,43.62 v46.42,43.62
  Bottom 0.152: 42.46,41.52 42.87,41.93 42.87,42.71 41.77,43.81 41.75,43.81 U5.2 41.09,44.47 41.09,44.81 41.72,45.44 42,45.44 | 42.45,41.52 42.46,41.52 | U8.9 49.5,36.84 | v33.73,48.71 36.04,51.03 36.04,54.42 36.55,54.92 37.31,54.92 37.72,54.52 37.72,49.83 v37.22,49.34 | v40.36,40.7 40.89,41.23 41.4,41.23 41.59,41.04 41.98,41.04 U5.13 | v43.65,46.77 43.66,46.77 44.7,47.81 46.2,47.81 v47.37,48.98 48.14,48.98 | v43.65,46.77 43.53,46.77 44.13,46.18 44.13,45.08 45.58,43.62 v46.42,43.62 | 42,45.44 42.19,45.44 43.52,46.77 v43.65,46.77 | U5.4 42,44.98 42,45.44 | U5.13 42.46,41.52 | U5.13 | U5.4
  Bottom 0.203: U8.9 49.52,45.55 50.27,46.29 3.3V.1 49.31,47.81 48.14,48.98
  Bottom 0.254: 3.3V.1 50.27,48.6 50.22,48.65 U6.3 U6.2
5V  (via drill 0.3)
  Top 0.152: 43.91,29.2 U1.24 43.89,29.18 v44.65,28.42 44.82,28.27 45.46,27.62 v46.48,27.62 46.71,27.39 47.12,27.39 47.47,27.04 47.47,26.25 | U1.44 43.54,37.2 44.45,38.11 v44.45,38.33 | U7.5 36.29,47.31 35.99,47.31 35.47,47.84 32.51,47.84 31.98,47.3 31.98,46.47 T7.2 | 39.4,31.68 U1.14 39.41,31.68 v38.52,30.78 38.01,30.27 R4.2 | U1.34 v47.75,32.98
  Top 0.203: U4.3 49.45,47.25 49,46.8 v49,46.29 49,45.62 49.26,45.35 U4.1 | v31.77,33.49 31.22,34.05 31.22,35.37 29.69,36.89 29.69,38.41 30.36,39.09 30.36,40.87 29.25,41.98 27.35,41.98 26.85,42.49 26.85,45.92 28.41,47.48 30.32,47.48 ICSP.2 31.41,46.39 T7.2 | R4.2 36.45,30.2 35.93,29.68 33.62,29.68 v33.36,29.42 | 47.47,26.25 R7.2
  Top 0.254: U3.1 52.58,44.57 51.8,45.35 U4.1 | C7.1 49,44.08 49,45.62
  Bottom 0.152: 49,42.61 46.71,40.32 46.71,38.91 46.38,38.58 44.7,38.58 v44.45,38.33 | v31.77,33.49 31.47,33.18 31.47,31.56 32.36,30.67 32.36,29.97 32.91,29.42 v33.36,29.42 | v46.48,27.62 46.73,27.62 47.51,28.39
  Bottom 0.203: v49,46.29 49,42.61 49,38.73 47.75,37.49 v47.75,32.98 47.51,32.74 47.51,28.39 | v44.65,28.42 44,28.42 43.41,29.02 40.28,29.02 v38.52,30.78
A0
  Top 0.152: U1.36 46.99,34.99 A0.1
A1
  Top 0.152: U1.37 46.91,35.62 48.49,35.62 49,36.13 A1.1
A2
  Top 0.152: U1.38 46.71,36.13 48.09,36.13 49.24,37.27 A2.1 49.07,37.27
A3
  Top 0.152: U1.39 46.36,36.48 47.9,36.48 48.49,37.07 48.49,37.91 49,38.41 A3.1
A4
  Top 0.152: U1.40 44.96,35.78 46.46,37.27 A4.1
A5
  Top 0.152: U1.41 46.88,38.41 A5.1
D4
  Top 0.152: 47.13,27.95 47.13,27.94 | 47.13,27.94 48.95,26.12 D4.1 | 47.13,27.94 46.81,28.25 45.72,28.25 44.83,29.14 44.65,29.14 44.24,29.55 U1.25
D5  (via drill 0.3)
  Top 0.152: U1.31 46.37,31.68 48.18,29.87 50.81,29.87 v51.18,29.5 | v31.66,30.32 31.89,30.1 35.38,30.1 35.66,30.38 35.66,36.59 34.06,38.19 34.06,39.1 33.74,39.42 D5.1
  Bottom 0.152: v31.66,30.32 31.66,29.93 34.52,27.07 37.27,27.07 38.23,26.12 47.48,26.12 48.44,27.07 50.71,27.07 51.18,27.54 v51.18,29.5
D6  (via drill 0.3)
  Top 0.152: U1.27 45.91,29.31 v46.18,29.31 | v36.89,53.07 36.94,53.12 D6.1
  Bottom 0.152: v46.18,29.31 39.09,36.4 39.09,41.83 36.3,44.62 36.3,50.01 36.88,50.59 v36.88,53.07 v36.89,53.07
D7
  Top 0.152: U1.1 42.24,37.19 39.18,40.26 39.18,45.92 D7.1
D8
  Top 0.152: D8.1 48.14,28.25 46.46,29.94 45.99,29.94 45.31,30.62 U1.28
D9
  Top 0.152: U1.29 45.67,30.97 46.32,30.32 46.63,30.32 47.92,29.04 50.13,29.04 51.4,27.77 52.98,27.77 53.44,28.23 53.44,30.26 52.95,30.75 R15.1 52.95,32.9 R16.1
D10  (via drill 0.3)
  Top 0.152: 48.41,56.88 R12.1 48.16,56.88 46.44,55.16 R11.1 47.22,54.54 47.55,54.21 v48.88,54.21 v48.89,54.22 | v52.78,28.51 51.24,28.51 50.28,29.47 48.07,29.47 46.84,30.71 46.63,30.71 46.02,31.32 U1.30 | v52.93,38.35 53.53,37.75 v53.53,36.52
  Bottom 0.152: v52.93,38.35 52.13,39.15 50.7,39.15 50.06,39.79 50.06,45.34 50.91,46.19 50.91,48.69 48.49,51.11 48.49,53.82 v48.89,54.22 | 53.75,36.33 v53.53,36.52 53.78,36.27 53.78,34.51 52.78,33.51 v52.78,28.51
D11  (via drill 0.3)
  Top 0.152: U1.12 38.73,32.36 | U1.12 38.72,32.38 | v38.15,32.99 38.73,32.41 U1.12 | v54.25,38.38 54.25,36.2 v53.11,35.06
  Bottom 0.152: v38.15,32.99 37.84,32.69 37.84,30.53 39.09,29.28 39.09,27.75 39.34,27.49 39.93,27.49 40.44,28 43.1,28 44.63,26.48 47.33,26.48 48.28,27.43 48.28,31.33 48.51,31.56 50.62,31.56 50.77,31.71 50.77,32.23 51.54,32.99 51.54,34.22 52.37,35.06 v53.11,35.06 | R20.1 50.72,39.85 51.07,39.51 53.11,39.51 v54.25,38.38
  Bottom 0.203: R19.1 R20.1
D12
  Top 0.152: D12.1 48.41,27.19 46.94,28.66 45.85,28.66 44.6,29.91 U1.26
D13  (via drill 0.3)
  Top 0.152: U1.32 48.46,30.29 51.38,30.29 v52.15,29.52
  Bottom 0.152: 34.92,25.54 43.2,25.54 43.43,25.77 48.3,25.77 48.55,25.51 50.58,25.51 50.9,25.83 51.8,26.73 51.8,26.95 52.15,27.29 v52.15,29.52
  Bottom 0.203: R17.1 R18.1 37.58,41.26 37.9,40.94 37.9,38.73 37.06,37.89 34.77,37.89 30.9,34.02 30.9,30.02 33.96,26.96 33.96,26.5 34.92,25.54
GND  (via drill 0.3, 0.6, 0.7, 0.8)
  Top 0.152: U1.35 47.31,34.6 48.42,34.6 48.79,34.24 50.48,34.24 | 40.84,35.78 U1.5 40.85,35.78 37.16,39.47 v37.16,40.29 36.41,41.03 36.41,44.09 | C1.1 36.41,44.09 | U1.43 43.91,36.84 45.58,38.5 45.58,40.65 v45.83,40.9 | C4.2 50.17,41.28 49.67,41.78 | 49.67,41.78 C5.1 | v45.83,40.9 46.14,41.21 47.22,41.21 47.79,41.78 49.67,41.78 | 36.41,44.09 R24.1 36.41,45.9 36.8,46.29 36.8,47.81 36.04,47.81 35.64,48.22 U7.2 | U1.15 39.78,31.32 39.22,30.76 39.22,30.55 38.52,29.85 37.35,29.85 36.77,29.27 34.26,29.27 33.41,28.42 33.41,27.24 | R1.1 50.1,33.85 50.1,33.86 50.48,34.24 | 33.41,27.24 30.71,29.94 30.71,31.49 v29.89,32.31 | 50.48,34.24 51.31,35.06 v51.31,38.07 | Y1.2 35.77,26.21 35.41,25.84 34.02,25.84 33.41,26.45 33.41,27.24 | C3.2 v46.31,45.8 v46.3,45.79 46.24,45.73 43.87,45.73 43.52,45.38 U2.18 | U1.23 43.58,28.85 43.99,28.43 43.99,28.04 v44.96,27.12 | U2.1 39.59,41.49 39.57,41.49 39.57,40.47 41.54,38.5 v42,38.5 42.92,39.43 44.3,39.46 44.75,39.91 44.75,40.8 44.22,41.31 U2.9 | U2.11 45.83,41.19 v45.83,40.9
  Top 0.203: R11.2 T2.2 | LED3.C 52.45,59.72 52.32,59.85 v50.72,59.85 v50.71,59.84 | 34.62,58.99 JP2.SHIELD1 | JP2.GND1 32.65,54.05 32.54,54 | 32.54,54 32.14,53.8 31.89,53.37 v31.64,52.17 JP2.SHIELD2 | JP2.SHIELD3 32.54,54
  Top 0.254: U4.2 51.26,46.3 51.66,46.71 51.66,49.02 v51.34,49.34 50.89,48.88 R25.2 | U3.2 53.53,43.47 53.14,43.08 | C5.1 50.52,42.68 | 50.52,42.68 50.76,42.68 51.16,43.08 v51.66,43.08 52.55,43.08 | 52.55,43.08 53.14,43.08 | 53.14,43.08 53.52,43.08 53.97,42.62 C8.1 | C2.1 52.55,41.66 52.55,43.08 | v39.85,57.92 39.91,57.3 | C7.2 50.52,43.9 50.52,42.68
  Top 0.5: v50.01,52.64 48.61,52.64 T2.2
  Top 0.813: v51.31,38.07 51.45,38.07 52.04,37.47 | 34.62,58.99 42.9,58.99 45.53,56.36 v45.95,56.36
  Bottom 0.152: 43.83,41.73 43.28,42.28 43.28,42.64 43.64,43 43.98,43 44.4,42.58 44.44,42.58 44.53,42.49 | R17.2 34.52,39.48 | v46.3,45.79 47.84,44.26 47.84,42.91 v45.83,40.9 45.83,40.21 45.63,40 44.6,40 | 44.6,40 C10.2 | 30.2,35.37 30.07,35.49 | 51.98,37.4 51.03,36.45 51.03,33.08 50.26,32.32 U8.12 48.3,32.32 47.92,31.94 47.92,27.58 47.32,26.98 45.1,26.98 v44.96,27.12 | 44.42,40.18 44.6,40 | C10.2 44.63,40 | 44.53,42.49 45.13,41.89 45.13,41.54 44.61,41.02 C10.2 | v42,38.5 42,38.53 42.62,39.13 43.57,39.13 44.44,39.99 C10.2 | 44.54,42.44 44.53,42.45 44.53,42.49
  Bottom 0.203: 34.52,39.48 34.52,38.67 34.77,38.41 36.55,38.41 37.16,39.02 v37.16,40.29 | v45.95,56.36 45.95,56.42 43.38,58.99 41.63,58.99 40.11,58.99 39.85,58.73 | v50.71,59.84 50.71,59.3 51.15,58.86
  Bottom 0.254: 39.6,58.99 39.85,58.73 v39.85,57.92 | 54.13,46.54 54.33,46.54 | 53.57,46.29 53.82,46.29 54.33,46.8 | U$20.1 54.33,47.81 | v51.34,49.34 54.33,49.34 | 30.2,34.86 30.2,32.61 v29.89,32.31 | v51.66,43.08 54.24,43.08 54.33,42.99 | R19.2 53.15,42.03 T6.2
  Bottom 0.305: U6.7 42.26,51.5 41.63,52.13 41.63,58.99
  Bottom 0.4: 34.14,57.85 34.01,57.85 33.88,57.85 | 33.76,57.85 33.63,57.85
  Bottom 0.406: T5.2 33.38,38.8
  Bottom 0.5: v50.01,52.64 51.54,51.11 54.58,51.11 | 33.08,38.5 32.73,38.15 30.07,35.49 | 33.88,57.85 33.76,57.85 | ICSP.6 27.06,43.08 25.88,44.26 | v30.77,38.01 29.31,36.55 29.31,36.26 | 34.01,57.49 34.01,57.85
  Bottom 0.508: 30.2,35.37 30.2,34.86 | 32.73,38.15 33.38,38.8 33.98,39.41 34.44,39.41 R17.2
  Bottom 0.6: T6.2 54.1,42.99 54.33,42.99 56.71,42.99 GND.1 60.43,43.68 | 51.98,37.4 v51.31,38.07
  Bottom 0.61: 51.98,37.4 54.57,37.4 56.18,39.01 57.72,39.01 58.1,39.38
  Bottom 0.9: 32.49,56.7 30.71,54.92 30.71,51.37 25.88,46.54 25.88,44.26 | 25.88,39.68 29.31,36.26 30.07,35.49
  Bottom 1.5: 55.09,51.62 55.35,51.88 55.35,54.67 51.15,58.86 51.03,58.99 | 39.6,58.99 34.77,58.99 33.63,57.85 32.49,56.7
  Bottom 2: GND.1 55.68,45.19 54.33,46.54 54.33,46.8 54.33,47.81 54.33,49.34 54.33,50.86 54.58,51.11 55.09,51.62
  other vias: 54.4,33.51 41.78,60.03 57.1,39.02 49.44,58.57 38.64,54.53
  pour Top (isolate 0.254, hatched): 37.9,61.4 48.02,61.38 48.07,61.4 53.36,61.4 60.55,48.71 56.36,46.29 58.65,41.97 63.09,44.33 63.85,42.91 53.5,24.61 48.35,24.56 32.49,24.7 27.57,33.54 24.37,39.92 24.23,46.01 27.63,52.31 33.2,49.06 37.91,58.06 37.88,59.66
  pour Bottom (isolate 0.254, hatched): 24.34,61.07 61.62,61.02 61.69,24.19 51.79,24.19 51.79,38.43 34.01,38.43 34.01,24.19 24.25,24.19
M2_LIGHT  (via drill 0.3)
  Top 0.203: LED6.C v41.23,74.02 v41.22,74.03
  Top 0.61: v51.08,53.58 50.9,53.88 50.57,54.21 T2.1
  Bottom 0.203: v41.22,74.03 41.66,74.03 LED7.C
  Bottom 0.61: M2.P$1 42.27,74.64 LED7.C 42.15,62.41 v51.08,53.58
M4_LIGHT  (via drill 0.3, 0.5)
  Top 0.203: v40.94,11.52 41.64,11.52 LED8.C
  Top 0.61: T4.1 54.41,35.46 55.21,36.27 v55.86,36.92
  Bottom 0.203: LED9.C v40.95,11.52 v40.94,11.52
  Bottom 0.61: 42.27,11.41 42.27,23.74 43.45,24.92 51,24.92 54.26,28.18 54.26,28.72 55.13,29.6 55.13,30.92 55.87,31.65 55.87,35.73 v55.86,36.92 | M4.P$1 42.27,11.41 | 42.27,11.41 LED9.C
M6_LIGHT  (via drill 0.3)
  Top 0.203: LED10.C 73.9,41.2 v73.91,41.18
  Bottom 0.203: v73.91,41.18 73.91,41.78 LED11.C
  Bottom 0.5: T6.1 55.42,41.29
  Bottom 0.61: 55.42,41.29 60.25,41.29 61.24,42.28 76.79,42.28 M6.P$1 76.78,42.27 LED11.C
M8_LIGHT  (via drill 0.3)
  Top 0.203: LED5.C v11.73,44.69
  Bottom 0.203: v11.73,44.69 LED4.C
  Bottom 0.508: 8.84,43.49 M8.P$1 8.91,43.6
  Bottom 0.61: T5.1 27.3,40.37 24.08,43.59 11.74,43.59 LED4.C 11.72,43.6 8.91,43.6
MISO  (via drill 0.3)
  Top 0.152: U1.11 38.72,33.66 | U1.11 37.82,34.57 37.82,35.62 34.87,38.57 34.87,39.49 30.43,43.94 v29.98,43.94
  Top 0.203: 38.72,33.66 U1.11
  Bottom 0.203: ICSP.1 31.47,48.07 31.47,45.42 v29.98,43.94
MOSI
  Top 0.152: U1.10 39.07,34.01 39.07,34.02 U1.10 38.19,34.9 38.19,35.85 35.23,38.81 35.23,39.74 30.34,44.62
  Top 0.203: ICSP.4 29.71,44.62 30.34,44.62
N$1
  Top 0.152: U1.17 40.45,30.62 40.45,30.59 38.84,28.98 37.67,28.98 36.98,28.29 Y1.1
N$2
  Top 0.152: 34.58,27.18 Y1.3 34.59,27.19 34.59,28.5 34.99,28.89 36.97,28.89 37.52,29.44 38.61,29.44 40.14,30.97 U1.16
N$3
  Top 0.152: 42.9,54.04 R2.1
  Top 0.203: R2.1 42.75,54.05 42.75,54.87 42.19,55.46 37.69,55.46 36.27,54.04 35.28,54.04 JP2.D+1
N$4
  Top 0.203: R3.1 44.09,54.75 42.85,55.99 37.54,55.99 36.09,54.54 35.65,54.54 JP2.D-1 34.87,55.08
N$5
  Top 0.152: U1.6 40.5,35.43 U1.6 36.36,39.54 36.36,40.32 34.87,41.81 C1.2
N$6
  Top 0.152: U1.42 44.25,36.49 45.95,38.19 45.95,38.64 46.34,39.04 50.82,39.04 51.21,39.42 C2.2
N$8  (via drill 0.3)
  Top 0.152: v47.73,39.8 47.73,39.84 48.2,40.31 C4.1 | U2.10 45.19,41.13 45.19,39.43 44.78,39.02 43.59,39.02 v42.94,38.38
  Bottom 0.152: v47.73,39.8 47.73,38.67 46.1,37.04 43.51,37.04 42.94,37.61 v42.94,38.38
N$9
  Top 0.152: U2.20 41.53,45.49 41.53,45.73 41.93,46.14 44.12,46.14 45.01,47.02 C3.1
N$10
  Top 0.152: LED1.A 43.89,26.73 44.5,26.12 46.05,26.12 R7.1
N$11
  Top 0.152: U1.33 48.03,31.43 R1.2
N$12
  Bottom 0.152: 34.54,41.28 32.76,41.28 T5.3
  Bottom 0.203: R18.2 34.54,41.28
N$13
  Top 0.152: LED3.A 52.36,57.6
  Top 0.254: 52.36,57.6 52.17,57.8 R21.1
N$14
  Top 0.203: R12.2 49.76,56.78 49.76,55.94 49.38,55.56 49,55.18 T2.3
N$15
  cutout Bottom: 58.8,51.85 53.8,49.01 55.98,44.61 61.31,47.63 58.91,51.95
N$17  (via drill 0.3)
  Top 0.203: R27.1 42.25,14.35 v43.26,13.34 43.65,12.95 LED8.A
  Bottom 0.203: v43.26,13.34 43.64,12.96 43.64,11.53 LED9.A
N$20
  Top 0.152: T4.3 52.38,35.52 51.64,34.78 R16.2
N$21  (via drill 0.3)
  Top 0.203: R28.1 72.15,42.37 v72.92,43.14 73.55,43.77 LED10.A
  Bottom 0.203: 73.41,43.62 v72.92,43.14 73.55,43.77 LED11.A
N$22  (via drill 0.3)
  Top 0.203: R23.1 42.25,72.11 v43.03,72.88 43.65,73.51 LED6.A
  Bottom 0.203: v43.03,72.88 43.65,73.51 LED7.A
N$23
  Bottom 0.152: C9.1 45.98,44.38 46.84,44.38 47.22,44 47.22,43.22 46.69,42.68 45.19,42.68 44.41,43.46 | 44.41,43.46 44.4,43.46 44.4,43.47 44.53,43.6 44.54,43.6 | U5.8 44.41,43.47 44.41,43.46
N$24  (via drill 0.3)
  Top 0.203: LED5.A 12.15,42.06 v12.8,42.71 13.63,43.53 R22.1
  Bottom 0.203: v12.8,42.71 12.29,42.2 11.85,42.2 LED4.A
N$25
  Top 0.203: U3.6
  Top 0.254: U3.6 52.63,46.89 C6.1
N$27
  Top 0.203: U3.4
  Top 0.254: U3.4 54.48,48.23 C6.2
N$28
  Bottom 0.152: C9.2 46.76,46.68 48.4,45.04 48.4,42.55 46.33,40.48 46.33,39.54 45.81,39.02 44.02,39.02 43.66,38.67 43.66,37.75 43.95,37.46 45.88,37.46 45.89,37.46 47.07,38.63 47.07,40.12 47.4,40.45 48.23,40.45 48.49,40.19 48.49,38.85 46.3,36.66 42.33,36.66 41.29,37.7 41.29,40.36 41.64,40.71 42.23,40.71 42.3,40.78 42.89,40.78 43.48,41.36 43.48,41.38 U5.12 | U5.12
N$29
  Bottom 0.152: 44.05,42.23 U5.10 44.24,42.04 44.5,41.77 44.5,41.34 43.15,39.99 C10.1 42.92,39.99
N$31
  Bottom 0.203: T6.3 52.31,40.32 52.27,40.36 R20.2
N$34
  Top 0.152: U7.4 34.99,46.29 | 34.99,46.29 34.99,45.45 R24.2 | T7.3 33.83,46.29 34.99,46.29
N$35  (via drill 0.3)
  Top 0.152: 38.52,26 R26.2 38.52,26.39 v38.52,27.35
  Bottom 0.152: v38.52,27.35 38.37,27.35 37.57,28.15 37.57,29.78 36.53,30.82 U8.4
RESET
  Top 0.152: U1.13 39.08,32.01 | 29.36,43.24 30.54,43.24 34.47,39.32 34.47,38.38 36.45,36.4 R4.1 36.55,31.47 38.52,31.47 39.08,32.03 U1.13 | U1.13 39.06,32.03
  Top 0.203: ICSP.5 29.36,43.24
RX  (via drill 0.3)
  Top 0.152: U1.20 41.56,29.45 41.47,29.45 41.47,29.44 | 41.47,29.44 41.44,29.44 | 41.47,29.44 40.52,28.5 v40.52,27.06
  Bottom 0.152: U8.2 37.09,27.82 38.38,26.53 39.99,26.53 v40.52,27.06
SCK
  Top 0.152: U1.9 39.43,34.36 38.58,35.21 38.58,36 35.59,39 35.59,39.89 31.47,44 31.47,44.6
  Top 0.203: 31.47,44.6 ICSP.3
SCL  (via drill 0.3)
  Top 0.152: U1.18 40.84,30.26 40.84,30.22 40.82,30.22 40.03,29.44 39.91,29.44 38.73,28.25 v38.39,28.25 | v37.43,48.32 37.43,43 v37.16,42.73 | U2.23 40.46,44.38 40.46,44.76 40.72,45.02 40.72,45.42 42.09,46.8 v42.61,46.8 42.61,47.99 R5.1
  Bottom 0.152: v38.39,28.25 38.07,28.57 38.07,29.78 37.49,30.36 37.49,33.65 38.58,34.74 38.58,41.31 v37.16,42.73 | 42.15,46.34 v42.61,46.8 | 41.86,46.05 41.87,46.05 | 41.87,46.05 v42.61,46.8 | v37.43,48.32 37.44,48.31 SCL.1 37.44,45.95 37.86,45.53 39.09,45.53 39.62,46.05 40.74,46.05 | U6.5 44.16,48.35 v42.61,46.8 | 40.74,46.05 41.87,46.05 | U5.1 40.74,44.12 40.74,46.05 | 41.4,43.46 U5.1 | U5.1
SDA  (via drill 0.3)
  Top 0.152: 41.2,29.9 U1.19 41.2,29.88 39.75,28.43 v39.75,28.25 | U2.24 39.61,44.52 39.61,44.9 v39.9,45.2 41.25,46.54 v41.25,47.05 41.25,47.9 R6.1
  Bottom 0.152: v39.75,28.25 40.05,28.56 43.23,28.56 44.02,27.77 45.03,27.77 45.52,28.25 46.75,28.25 47.12,28.62 47.12,29.37 39.61,36.88 39.61,43.34 | 39.61,43.34 39.61,44.9 v39.9,45.2 | 38.91,46.59 SDA.1 40.99,46.8 v41.25,47.05 42.66,48.46 U6.6 | 41.4,42.58 40.64,43.34 39.61,43.34 | 41.4,42.58 41.26,42.44 | U5.16 41.4,42.58 | 41.4,42.58
TX
  Top 0.152: 41.91,29.14 U1.21 41.2,28.49 41.2,26.58 40.85,26.24 R26.1
TXLED
  Top 0.152: U1.22 41.63,28.21 41.63,27.25 LED1.C
USBD+  (via drill 0.3)
  Top 0.152: 41.2,36.14 U1.4 37.92,39.41 37.92,47.8 38.34,48.22 v38.34,48.98 | 41.31,54.04 R2.2
  Top 0.203: R2.2 40.72,54.04 v40.31,54.44
  Bottom 0.152: v38.34,48.98 38.34,52.93 39.85,54.44 v40.31,54.44
USBD-  (via drill 0.3)
  Top 0.152: U1.3 38.33,39.71 38.33,47.56 v39.09,48.32 | R3.2
  Top 0.203: v40.31,53.31 40.68,52.94 R3.2
  Bottom 0.152: v39.09,48.32 39.09,52.09 v40.31,53.31
VCC  (via drill 0.3)
  Top 0.152: 55.06,45.49 55.09,45.53 | U3.3 54.48,45.53 | 36.29,50.85 35.04,50.85 35.03,50.87 | 48.87,50.74 54.91,50.74 55.04,50.86
  Top 0.203: 31.95,50.84 32.05,50.86 | 35.03,50.86 35.03,50.87 | U7.1 36.29,50.85 36.3,50.86 | 55.47,45.53 55.47,42.62 C8.2
  Top 0.254: 53.57,46.85 53.57,45.78 53.82,45.53 54.48,45.53 55.09,45.53 55.47,45.53 56.36,45.53 | 54.84,52.64 54.84,54.42 52.76,56.5 R21.2 | R25.1 48.87,50.74 48.74,50.86
  Top 0.5: 54.84,50.86 54.84,50.61 | U3.5 53.57,46.85 | 58.52,41.71 58.52,42.1 | 57.53,43.08 57.3,43.32 | 54.25,53.23 54.84,52.64 54.93,52.55 55.04,52.44
  Top 0.508: 14.82,42.24 R22.2
  Top 0.559: 55.04,52.44 55.04,50.86 55.04,50.66 | M2.P$2 44.8,75.75 44.8,73.09 43.55,71.83 R23.2 43.55,62.91 | v53.06,53.4 54.08,53.4 54.93,52.55 | M6.P$2 75.59,44.97 73.15,44.97 71.85,43.67 R28.2 62.58,43.67 59.66,40.75
  Top 0.61: 43.55,62.91 v43.53,62.62 | R27.2 43.55,14.8 | 43.55,19.71 43.53,19.72 | 43.53,23.5 45.24,25.21 | 59.58,39.1 59.66,39.18 | 56.62,35.13 | 54.27,28.01 54.28,28
  Top 0.66: M8.P$2 10.09,40.98 12.65,40.98 13.91,42.23 R22.2 14.85,42.28 24.82,42.28 25.93,43.39 25.93,46.33 29.62,50 | 43.55,14.8 44.86,13.5 44.86,10.34 M4.P$2 | R27.2 43.55,19.71 | 43.53,19.72 43.53,23.5 | 45.24,25.21 51.48,25.21 54.28,28 | 59.58,39.1 59.58,38.55 59.3,38.26 59.3,37.25 57.99,35.94 57.44,35.94 56.62,35.13 | 56.62,35.13 56.21,34.72 56.21,33.22 54.27,31.28 54.27,28.01
  Top 0.8: 59.66,40.95 59.66,40.75 59.66,39.18
  Top 0.914: 31.19,50 29.62,50
  Top 1: VCC.1 56.36,47.04 56.36,45.53 56.36,44.26 57.3,43.32 58.52,42.1 59.66,40.95
  Top 1.016: 54.84,50.86 36.3,50.86 32.05,50.86 31.19,50
  Top 2: VCC.1 57.34,48.36 55.04,50.66 54.84,50.86
  Bottom 0.61: v43.53,62.62 43.53,62.52 52.55,53.5 52.96,53.5 v53.06,53.4
VUSB  (via drill 0.3)
  Top 0.152: 41.94,36.84 U1.2 38.77,39.98 38.77,46.99 39.89,48.1 v39.89,48.97 | T7.1 32.87,43.23 35.98,40.12 35.98,39.23 U1.7
  Top 0.203: v32.87,45.49 T7.1 | v35.19,52.51 35.39,52.31 v40.31,52.31 42.98,52.31 43.15,52.13 44.86,52.13 45.36,52.64 45.36,54.33 44.21,55.48 44.2,55.48 43.13,56.55 35.98,56.55 35.08,55.66 JP2.VBUS1
  Bottom 0.203: v39.89,48.97 39.89,51.89 v40.31,52.31 | v32.87,45.49 32.87,48.9 35.19,51.23 v35.19,52.51

### Text on the board
tPlace: + | + | R12 | R21 | LED3 | T2 | D6 | R2 | R3 | R11 | MI | R25 | C6 | 5V | U7 | R6 | R5 | SCK | MO | D7 | C3 | U4 | RST | R24 | U3 | R22 | GND | T7 | C7 | + | + | C1 | U2 | + | LED5 | + | C5 | C8 | C4 | C2 | D5 | A5 | A3 | A4 | A2 | A1 | T4 | A0 | R16 | R4 | R1 | R15 | Y1 | D8 | D12 | D4 | R26 | LED1 | R7 | + | +
bPlace: LED7 | C9 | 3.3V | GND | SCL | SDA | LED4 | U5 | T6 | R19 | R18 | LED11 | C10 | R20 | R17 | V0.8 | U8 | LED9
bNames: GND